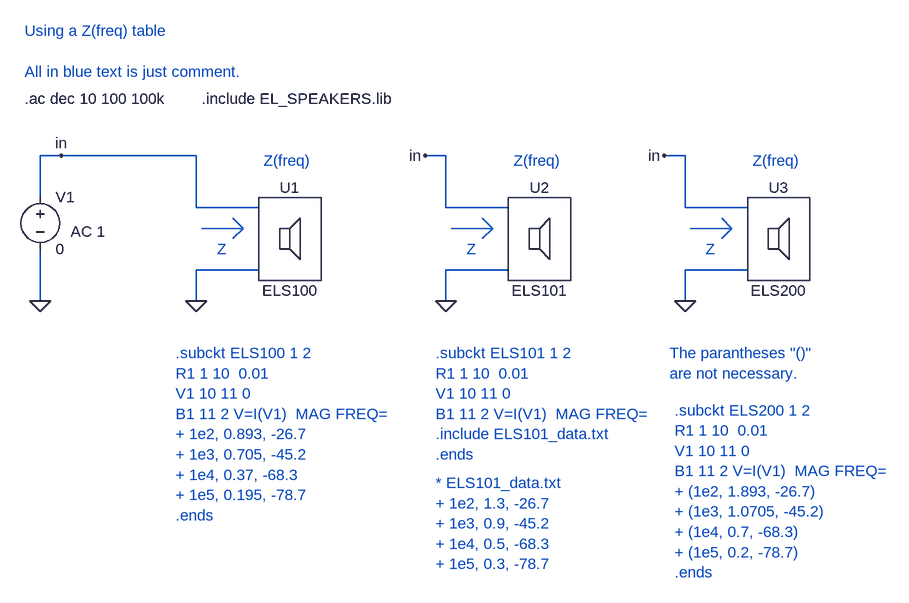
[diagram p0: schematic Z_imp_test.asc]
Z_imp_test.asc, the LTspice schematic file:
Version 4
SHEET 1 1364 680
WIRE -272 -304 -304 -304
WIRE -64 -304 -272 -304
WIRE 320 -304 288 -304
WIRE 688 -304 656 -304
WIRE -304 -240 -304 -304
WIRE -64 -224 -64 -304
WIRE 32 -224 -64 -224
WIRE 320 -224 320 -304
WIRE 416 -224 320 -224
WIRE 688 -224 688 -304
WIRE 784 -224 688 -224
WIRE 32 -128 -64 -128
WIRE 416 -128 320 -128
WIRE 784 -128 688 -128
WIRE -304 -80 -304 -160
WIRE -64 -80 -64 -128
WIRE 320 -80 320 -128
WIRE 688 -80 688 -128
FLAG -64 -80 0
FLAG -304 -80 0
FLAG -272 -304 in
FLAG 320 -80 0
FLAG 688 -80 0
FLAG 288 -304 in
FLAG 656 -304 in
SYMBOL voltage -304 -256 R0
WINDOW 123 47 69 Left 0
WINDOW 39 0 0 Left 0
SYMATTR Value2 AC 1
SYMATTR InstName V1
SYMATTR Value 0
SYMBOL EL_SPEAKER 80 -176 R0
SYMATTR Value ELS100
SYMATTR InstName U1
SYMBOL EL_SPEAKER 464 -176 R0
SYMATTR Value ELS101
SYMATTR InstName U2
SYMBOL EL_SPEAKER 832 -176 R0
SYMATTR Value ELS200
SYMATTR InstName U3
TEXT -328 -392 Left 0 !.ac dec 10 100 100k
TEXT -32 -160 Left 0 ;Z
TEXT -328 -496 Left 0 ;Using a Z(freq) table\n \nAll in blue text is just comment.
TEXT 40 -296 Left 0 ;Z(freq)
TEXT -56 -392 Left 0 !.include EL_SPEAKERS.lib
TEXT 352 -160 Left 0 ;Z
TEXT 424 -296 Left 0 ;Z(freq)
TEXT 720 -160 Left 0 ;Z
TEXT 792 -296 Left 0 ;Z(freq)
TEXT 304 0 Left 0 ;.subckt ELS101 1 2 \nR1 1 10  0.01\nV1 10 11 0\nB1 11 2 V=I(V1)  MAG FREQ=\n.include ELS101_data.txt\n.ends
TEXT -96 0 Left 0 ;.subckt ELS100 1 2 \nR1 1 10  0.01\nV1 10 11 0\nB1 11 2 V=I(V1)  MAG FREQ=\n+ 1e2, 0.893, -26.7 \n+ 1e3, 0.705, -45.2 \n+ 1e4, 0.37, -68.3 \n+ 1e5, 0.195, -78.7\n.ends
TEXT 672 88 Left 0 ;.subckt ELS200 1 2 \nR1 1 10  0.01\nV1 10 11 0\nB1 11 2 V=I(V1)  MAG FREQ=\n+ (1e2, 1.893, -26.7) \n+ (1e3, 1.0705, -45.2) \n+ (1e4, 0.7, -68.3) \n+ (1e5, 0.2, -78.7)\n.ends
TEXT 304 200 Left 0 ;* ELS101_data.txt\n+ 1e2, 1.3, -26.7 \n+ 1e3, 0.9, -45.2 \n+ 1e4, 0.5, -68.3 \n+ 1e5, 0.3, -78.7
TEXT 664 0 Left 0 ;The parantheses "()" \nare not necessary.
LINE Normal 8 -192 -56 -192
LINE Normal -8 -208 8 -192
LINE Normal -8 -208 -8 -208
LINE Normal 8 -192 -8 -208
LINE Normal -8 -176 8 -192
LINE Normal -8 -176 -8 -176
LINE Normal 392 -192 328 -192
LINE Normal 376 -208 392 -192
LINE Normal 376 -208 376 -208
LINE Normal 392 -192 376 -208
LINE Normal 376 -176 392 -192
LINE Normal 376 -176 376 -176
LINE Normal 760 -192 696 -192
LINE Normal 744 -208 760 -192
LINE Normal 744 -208 744 -208
LINE Normal 760 -192 744 -208
LINE Normal 744 -176 760 -192
LINE Normal 744 -176 744 -176

The netlist it stands for:
* Z_imp_test.asc
V1 in 0 0 AC 1
XU1 in 0 ELS100  ; pins P1 P2
XU2 in 0 ELS101  ; pins P1 P2
XU3 in 0 ELS200  ; pins P1 P2
.ac dec 10 100 100k
* Z
* Using a Z(freq) table
* All in blue text is just comment.
* Z(freq)
.include EL_SPEAKERS.lib
* Z
* Z(freq)
* Z
* Z(freq)
* .subckt ELS101 1 2
* R1 1 10  0.01
* V1 10 11 0
* B1 11 2 V=I(V1)  MAG FREQ=
* .include ELS101_data.txt
* .ends
* .subckt ELS100 1 2
* R1 1 10  0.01
* V1 10 11 0
* B1 11 2 V=I(V1)  MAG FREQ=
* + 1e2, 0.893, -26.7
* + 1e3, 0.705, -45.2
* + 1e4, 0.37, -68.3
* + 1e5, 0.195, -78.7
* .ends
* .subckt ELS200 1 2
* R1 1 10  0.01
* V1 10 11 0
* B1 11 2 V=I(V1)  MAG FREQ=
* + (1e2, 1.893, -26.7)
* + (1e3, 1.0705, -45.2)
* + (1e4, 0.7, -68.3)
* + (1e5, 0.2, -78.7)
* .ends
* * ELS101_data.txt
* + 1e2, 1.3, -26.7
* + 1e3, 0.9, -45.2
* + 1e4, 0.5, -68.3
* + 1e5, 0.3, -78.7
* The parantheses "()"
* are not necessary.
.backanno
.end